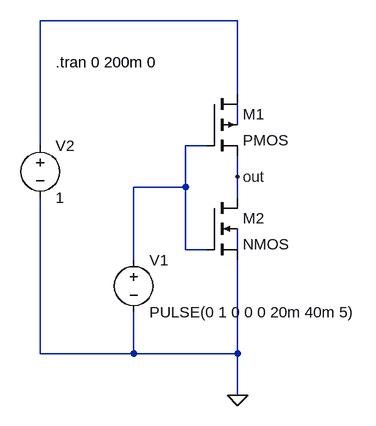
[diagram p0: schematic cmos.asc]
cmos.asc, the LTspice schematic file:
Version 4
SHEET 1 880 680
WIRE 272 -96 -32 -96
WIRE 272 16 272 -96
WIRE 272 64 272 32
WIRE -32 96 -32 -96
WIRE 224 96 192 96
WIRE 272 144 272 112
WIRE 192 160 192 96
WIRE 192 160 112 160
WIRE 272 176 272 144
WIRE 192 256 192 160
WIRE 224 256 192 256
WIRE 272 256 272 224
WIRE 112 272 112 160
WIRE -32 416 -32 176
WIRE 112 416 112 352
WIRE 112 416 -32 416
WIRE 272 416 272 272
WIRE 272 416 112 416
WIRE 272 480 272 416
FLAG 272 144 out
FLAG 272 480 0
SYMBOL voltage -32 80 R0
WINDOW 123 0 0 Left 0
WINDOW 39 0 0 Left 0
SYMATTR InstName V2
SYMATTR Value 1
SYMBOL pmos4 224 16 R0
SYMATTR InstName M1
SYMBOL nmos4 224 176 R0
SYMATTR InstName M2
SYMBOL voltage 112 256 R0
WINDOW 123 0 0 Left 0
WINDOW 39 0 0 Left 0
SYMATTR InstName V1
SYMATTR Value PULSE(0 1 0 0 0 20m 40m 5)
TEXT -8 -32 Left 2 !.tran 0 200m 0

The netlist it stands for:
* cmos.asc
V2 N001 0 1
M1 N001 N003 out N002 PMOS
M2 out N003 0 N004 NMOS
V1 N003 0 PULSE(0 1 0 0 0 20m 40m 5)
.model NMOS NMOS
.model PMOS PMOS
.lib standard.mos
.tran 0 200m 0
.backanno
.end